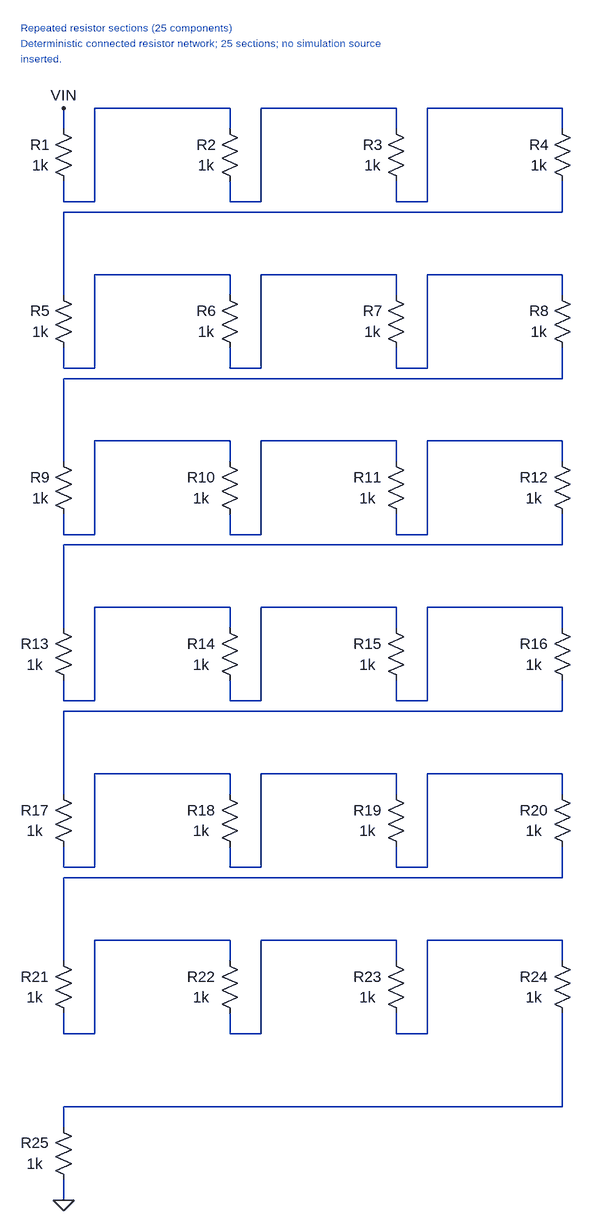
[diagram p0: schematic circuit.asc]
circuit.asc, the LTspice schematic file:
Version 4
SHEET 1 928 1904
SYMBOL res 64 128 R0
WINDOW 0 -20 40 Center 2
WINDOW 3 -20 72 Center 2
SYMATTR InstName R1
SYMATTR Value 1k
SYMBOL res 320 128 R0
WINDOW 0 -20 40 Center 2
WINDOW 3 -20 72 Center 2
SYMATTR InstName R2
SYMATTR Value 1k
SYMBOL res 576 128 R0
WINDOW 0 -20 40 Center 2
WINDOW 3 -20 72 Center 2
SYMATTR InstName R3
SYMATTR Value 1k
SYMBOL res 832 128 R0
WINDOW 0 -20 40 Center 2
WINDOW 3 -20 72 Center 2
SYMATTR InstName R4
SYMATTR Value 1k
SYMBOL res 64 384 R0
WINDOW 0 -20 40 Center 2
WINDOW 3 -20 72 Center 2
SYMATTR InstName R5
SYMATTR Value 1k
SYMBOL res 320 384 R0
WINDOW 0 -20 40 Center 2
WINDOW 3 -20 72 Center 2
SYMATTR InstName R6
SYMATTR Value 1k
SYMBOL res 576 384 R0
WINDOW 0 -20 40 Center 2
WINDOW 3 -20 72 Center 2
SYMATTR InstName R7
SYMATTR Value 1k
SYMBOL res 832 384 R0
WINDOW 0 -20 40 Center 2
WINDOW 3 -20 72 Center 2
SYMATTR InstName R8
SYMATTR Value 1k
SYMBOL res 64 640 R0
WINDOW 0 -20 40 Center 2
WINDOW 3 -20 72 Center 2
SYMATTR InstName R9
SYMATTR Value 1k
SYMBOL res 320 640 R0
WINDOW 0 -28 40 Center 2
WINDOW 3 -28 72 Center 2
SYMATTR InstName R10
SYMATTR Value 1k
SYMBOL res 576 640 R0
WINDOW 0 -28 40 Center 2
WINDOW 3 -28 72 Center 2
SYMATTR InstName R11
SYMATTR Value 1k
SYMBOL res 832 640 R0
WINDOW 0 -28 40 Center 2
WINDOW 3 -28 72 Center 2
SYMATTR InstName R12
SYMATTR Value 1k
SYMBOL res 64 896 R0
WINDOW 0 -28 40 Center 2
WINDOW 3 -28 72 Center 2
SYMATTR InstName R13
SYMATTR Value 1k
SYMBOL res 320 896 R0
WINDOW 0 -28 40 Center 2
WINDOW 3 -28 72 Center 2
SYMATTR InstName R14
SYMATTR Value 1k
SYMBOL res 576 896 R0
WINDOW 0 -28 40 Center 2
WINDOW 3 -28 72 Center 2
SYMATTR InstName R15
SYMATTR Value 1k
SYMBOL res 832 896 R0
WINDOW 0 -28 40 Center 2
WINDOW 3 -28 72 Center 2
SYMATTR InstName R16
SYMATTR Value 1k
SYMBOL res 64 1152 R0
WINDOW 0 -28 40 Center 2
WINDOW 3 -28 72 Center 2
SYMATTR InstName R17
SYMATTR Value 1k
SYMBOL res 320 1152 R0
WINDOW 0 -28 40 Center 2
WINDOW 3 -28 72 Center 2
SYMATTR InstName R18
SYMATTR Value 1k
SYMBOL res 576 1152 R0
WINDOW 0 -28 40 Center 2
WINDOW 3 -28 72 Center 2
SYMATTR InstName R19
SYMATTR Value 1k
SYMBOL res 832 1152 R0
WINDOW 0 -28 40 Center 2
WINDOW 3 -28 72 Center 2
SYMATTR InstName R20
SYMATTR Value 1k
SYMBOL res 64 1408 R0
WINDOW 0 -28 40 Center 2
WINDOW 3 -28 72 Center 2
SYMATTR InstName R21
SYMATTR Value 1k
SYMBOL res 320 1408 R0
WINDOW 0 -28 40 Center 2
WINDOW 3 -28 72 Center 2
SYMATTR InstName R22
SYMATTR Value 1k
SYMBOL res 576 1408 R0
WINDOW 0 -28 40 Center 2
WINDOW 3 -28 72 Center 2
SYMATTR InstName R23
SYMATTR Value 1k
SYMBOL res 832 1408 R0
WINDOW 0 -28 40 Center 2
WINDOW 3 -28 72 Center 2
SYMATTR InstName R24
SYMATTR Value 1k
SYMBOL res 64 1664 R0
WINDOW 0 -28 40 Center 2
WINDOW 3 -28 72 Center 2
SYMATTR InstName R25
SYMATTR Value 1k
WIRE 80 112 80 144
WIRE 80 224 80 256
WIRE 80 256 128 256
WIRE 80 272 80 400
WIRE 80 272 848 272
WIRE 80 480 80 512
WIRE 80 512 128 512
WIRE 80 528 80 656
WIRE 80 528 848 528
WIRE 80 736 80 768
WIRE 80 768 128 768
WIRE 80 784 80 912
WIRE 80 784 848 784
WIRE 80 992 80 1024
WIRE 80 1024 128 1024
WIRE 80 1040 80 1168
WIRE 80 1040 848 1040
WIRE 80 1248 80 1280
WIRE 80 1280 128 1280
WIRE 80 1296 80 1424
WIRE 80 1296 848 1296
WIRE 80 1504 80 1536
WIRE 80 1536 128 1536
WIRE 80 1648 80 1680
WIRE 80 1648 848 1648
WIRE 80 1760 80 1792
WIRE 128 112 128 256
WIRE 128 112 336 112
WIRE 128 368 128 512
WIRE 128 368 336 368
WIRE 128 624 128 768
WIRE 128 624 336 624
WIRE 128 880 128 1024
WIRE 128 880 336 880
WIRE 128 1136 128 1280
WIRE 128 1136 336 1136
WIRE 128 1392 128 1536
WIRE 128 1392 336 1392
WIRE 336 112 336 144
WIRE 336 224 336 256
WIRE 336 256 384 256
WIRE 336 368 336 400
WIRE 336 480 336 512
WIRE 336 512 384 512
WIRE 336 624 336 656
WIRE 336 736 336 768
WIRE 336 768 384 768
WIRE 336 880 336 912
WIRE 336 992 336 1024
WIRE 336 1024 384 1024
WIRE 336 1136 336 1168
WIRE 336 1248 336 1280
WIRE 336 1280 384 1280
WIRE 336 1392 336 1424
WIRE 336 1504 336 1536
WIRE 336 1536 384 1536
WIRE 384 112 384 256
WIRE 384 112 592 112
WIRE 384 368 384 512
WIRE 384 368 592 368
WIRE 384 624 384 768
WIRE 384 624 592 624
WIRE 384 880 384 1024
WIRE 384 880 592 880
WIRE 384 1136 384 1280
WIRE 384 1136 592 1136
WIRE 384 1392 384 1536
WIRE 384 1392 592 1392
WIRE 592 112 592 144
WIRE 592 224 592 256
WIRE 592 256 640 256
WIRE 592 368 592 400
WIRE 592 480 592 512
WIRE 592 512 640 512
WIRE 592 624 592 656
WIRE 592 736 592 768
WIRE 592 768 640 768
WIRE 592 880 592 912
WIRE 592 992 592 1024
WIRE 592 1024 640 1024
WIRE 592 1136 592 1168
WIRE 592 1248 592 1280
WIRE 592 1280 640 1280
WIRE 592 1392 592 1424
WIRE 592 1504 592 1536
WIRE 592 1536 640 1536
WIRE 640 112 640 256
WIRE 640 112 848 112
WIRE 640 368 640 512
WIRE 640 368 848 368
WIRE 640 624 640 768
WIRE 640 624 848 624
WIRE 640 880 640 1024
WIRE 640 880 848 880
WIRE 640 1136 640 1280
WIRE 640 1136 848 1136
WIRE 640 1392 640 1536
WIRE 640 1392 848 1392
WIRE 848 112 848 144
WIRE 848 224 848 272
WIRE 848 368 848 400
WIRE 848 480 848 528
WIRE 848 624 848 656
WIRE 848 736 848 784
WIRE 848 880 848 912
WIRE 848 992 848 1040
WIRE 848 1136 848 1168
WIRE 848 1248 848 1296
WIRE 848 1392 848 1424
WIRE 848 1504 848 1648
FLAG 80 1792 0
FLAG 80 112 VIN
TEXT 14 -12 Left 1 ;Repeated resistor sections (25 components)
TEXT 14 12 Left 1 ;Deterministic connected resistor network; 25 sections; no simulation source
TEXT 14 36 Left 1 ;inserted.

The netlist it stands for:
* circuit.asc
R1 VIN N001 1k
R2 N001 N013 1k
R3 N013 N019 1k
R4 N019 N002 1k
R5 N002 N003 1k
R6 N003 N014 1k
R7 N014 N020 1k
R8 N020 N004 1k
R9 N004 N005 1k
R10 N005 N015 1k
R11 N015 N021 1k
R12 N021 N006 1k
R13 N006 N007 1k
R14 N007 N016 1k
R15 N016 N022 1k
R16 N022 N008 1k
R17 N008 N009 1k
R18 N009 N017 1k
R19 N017 N023 1k
R20 N023 N010 1k
R21 N010 N011 1k
R22 N011 N018 1k
R23 N018 N024 1k
R24 N024 N012 1k
R25 N012 0 1k
* Repeated resistor sections (25 components)
* Deterministic connected resistor network; 25 sections; no simulation source
* inserted.
.backanno
.end